# Altium project Blinky_Stick.PrjPcb
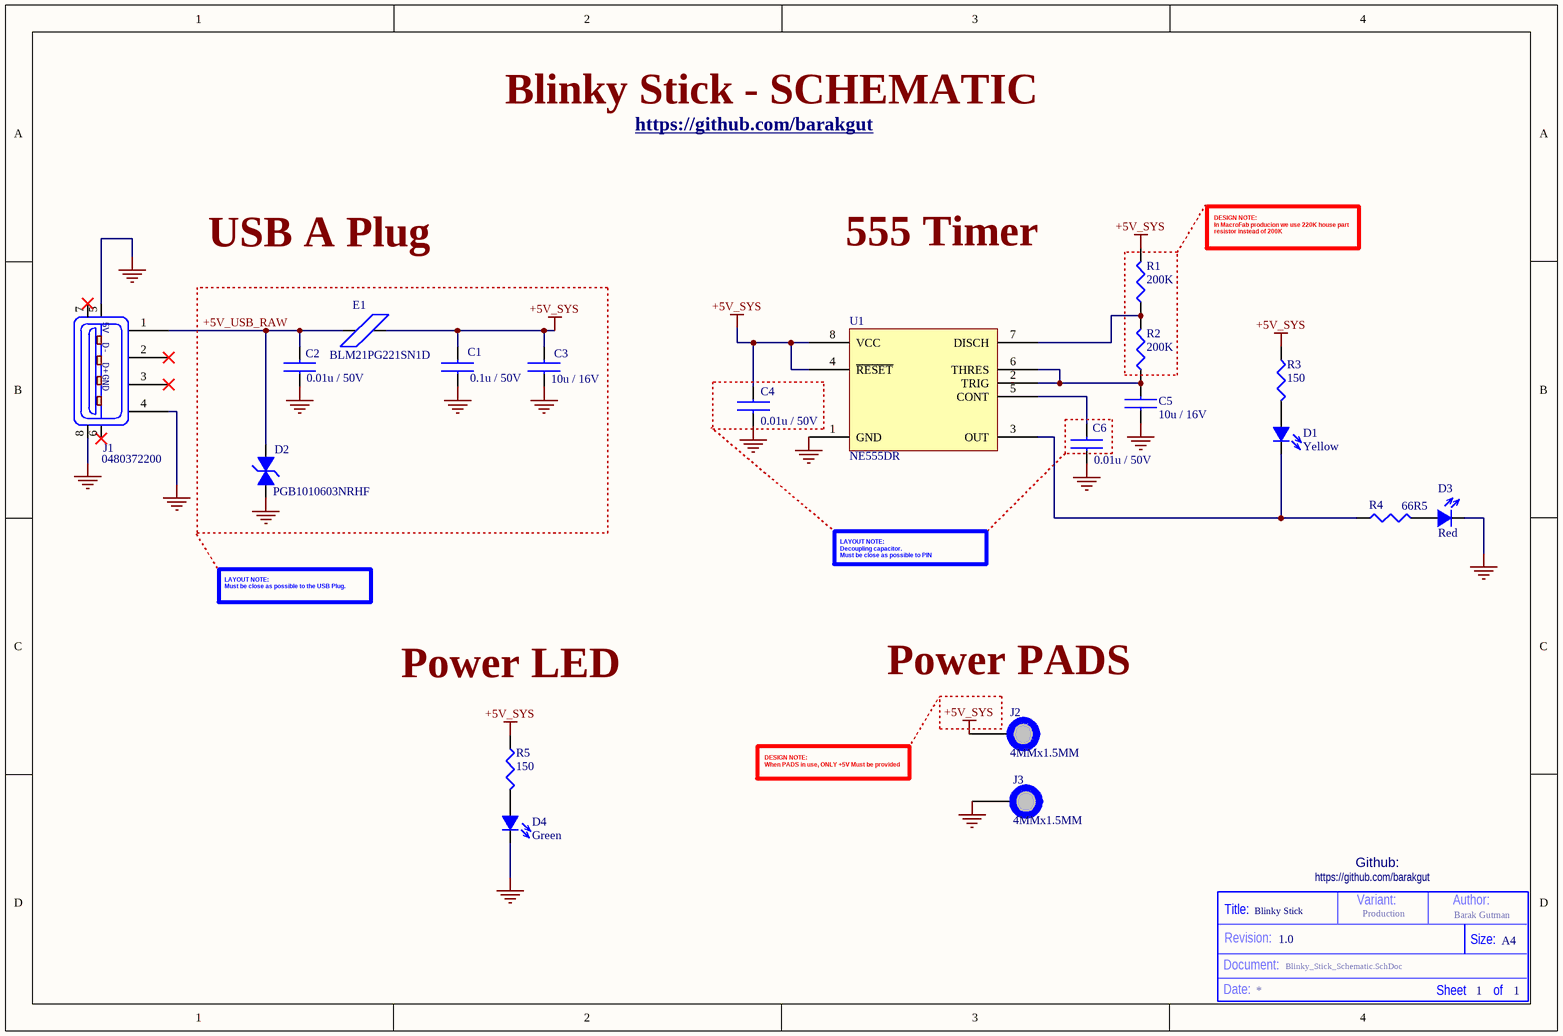
[diagram p0: Blinky_Stick_Schematic.SchDoc]
1 sheet, 20 parts. Net scope: global (net labels, ports and power ports of the same name join across sheets).
Board file: Blinky_Stick_PCB.PcbDoc

## Sheet Blinky_Stick_Schematic.SchDoc: Blinky Stick
size A4; Author: Barak Gutman; Revision: 1.0; SheetNumber: 1; SheetTotal: 1; Variant: Production

### Parts
C1  0.1u / 50V  [C0805]
C2  0.01u / 50V  [C0805]
C3  10u / 16V  [C0805]
C4  0.01u / 50V  [C0805]
C5  10u / 16V  [C0805]
C6  0.01u / 50V  [C0805]
D1  Yellow  [LED0805]
D2  PGB1010603NRHF  [DIODE_0603]
D3  Red  [LED0805]
D4  Green  [LED0805]
E1  BLM21PG221SN1D  [C0805]
J1  0480372200  [0480372200]
J2  4MMx1.5MM  [PAD_WITH_HOLE_4MMx1.5MM]  (no BOM)
J3  4MMx1.5MM  [PAD_WITH_HOLE_4MMx1.5MM]  (no BOM)
R1  200K  [R0805]
R2  200K  [R0805]
R3  150  [R0805]
R4  66R5  [R0805]
R5  150  [R0805]
U1  NE555DR  [SOIC-8_D_R-PDSO-G8]

### Nets
+5V_SYS: C1.2 C3.2 C4.2 E1.2 J2.1 R1.2 R3.1 R5.1 U1.4(~{RESET}) U1.8(VCC)
GND: C1.1 C2.1 C3.1 C4.1 C5.1 C6.1 D2.1 D3.2(Cathode) D4.2(Cathode) J1.4(GND) J1.5(GND) J1.8(MH) J3.1 U1.1(GND)
+5V_USB_RAW: C2.2 D2.2 E1.1 J1.1(5V)
NetC5_2: C5.2 R2.1 U1.2(TRIG) U1.6(THRES)
NetC6_2: C6.2 U1.5(CONT)
NetD1_1: D1.1(Anode) R3.2
NetD1_2: D1.2(Cathode) R4.1 U1.3(OUT)
NetD3_1: D3.1(Anode) R4.2
NetD4_1: D4.1(Anode) R5.2
NetR1_1: R1.1 R2.2 U1.7(DISCH)

Not connected (* = marked no-connect by the designer): J1 2(DM)* 3(DP)* 6(GND)* 7(MH)*

### Notes on the sheet
- Blinky Stick - SCHEMATIC
- https://github.com/barakgut
- DESIGN NOTE:
  In MacroFab producion we use 220K house part
  resistor instead of 200K
- USB A Plug
- 555 Timer
- LAYOUT NOTE:
  Decoupling capacitor.
  Must be close as possible to PIN
- LAYOUT NOTE:
  Must be close as possible to the USB Plug.
- Power LED
- (near J2) Power PADS
- DESIGN NOTE:
  When PADS in use, ONLY +5V Must be provided
- Title:
- Github:
- Variant:
- Author:
- Document:
- Revision:
- Size:
- A4
- Date:
- Sheet
- of
- (in symbol 0480372200) D-; D+

### Library data of the parts
C1 = C2012X7R1H104K085AA: CAP CER 0.1UF 50V X7R 0805; Manufacturer: TDK Corporation; Capacitance: 0.1µF; Tolerance: ±10%; Supplier 1: Digi-Key; Manufacturer Part Number: C2012X7R1H104K085AA; RoHS: RoHS Compliant; Category: Capacitors; Stock 1: 865489; Pricing 1: 1=0.11, 10=0.075, 25=0.0548, 50=0.0426, 100=0.0354, 250=0.02928, 500=0.0248, 1000=0.02053 (USD); Packaging: Cut Tape (CT); Part Status: Not For New Designs; Voltage - Rated: 50V; Temperature Coefficient: X7R; Operating Temperature: -55°C ~ 125°C; Features: Low ESL; Ratings: -; Applications: General Purpose; Failure Rate: -; Mounting Type: Surface Mount, MLCC; Package / Case: 0805 (2012 Metric); Size / Dimension: 0.079" L x 0.049" W (2.00mm x 1.25mm); Height - Seated (Max): -; Thickness (Max): 0.037" (0.95mm); Lead Spacing: -; Lead Style: -; ComponentLink1URL: https://product.tdk.com/info/en/catalog/datasheets/mlcc_commercial_general_en.pdf; ComponentLink1Description: https://product.tdk.com/info/en/catalog/datasheets/mlcc_commercial_general_en.pdf; Supplier Part Number 1: 445-7534-1-ND
C2 C4 C6 = C2012C0G1H103K060AA: CAP CER 10000PF 50V C0G 0805; Manufacturer: TDK Corporation; Tolerance: ±10%; Temperature Coefficient: C0G, NP0; Supplier 1: Digi-Key; Manufacturer Part Number: C2012C0G1H103K060AA; RoHS: RoHS Compliant; Category: Capacitors; Stock 1: 116011; Pricing 1: 1=0.35, 10=0.239, 25=0.1912, 50=0.1594, 100=0.1355, 250=0.1076, 500=0.09564, 1000=0.08368 (USD); Packaging: Cut Tape (CT); Part Status: Active; Capacitance: 10000pF; Voltage - Rated: 50V; Operating Temperature: -55°C ~ 125°C; Features: Low ESL; Ratings: -; Applications: General Purpose; Failure Rate: -; Mounting Type: Surface Mount, MLCC; Package / Case: 0805 (2012 Metric); Size / Dimension: 0.079" L x 0.049" W (2.00mm x 1.25mm); Height - Seated (Max): -; Thickness (Max): 0.030" (0.75mm); Lead Spacing: -; Lead Style: -; ComponentLink1URL: https://product.tdk.com/info/en/catalog/datasheets/mlcc_commercial_general_en.pdf; ComponentLink1Description: https://product.tdk.com/info/en/catalog/datasheets/mlcc_commercial_general_en.pdf; Supplier Part Number 1: 445-14311-1-ND
C3 C5 = C2012X5R1C106K085AC: CAP CER 10UF 16V X5R 0805; Manufacturer: TDK Corporation; Capacitance: 10µF; Tolerance: ±10%; Supplier 1: Digi-Key; Manufacturer Part Number: C2012X5R1C106K085AC; RoHS: RoHS Compliant; Category: Capacitors; Stock 1: 352135; Pricing 1: 1=0.24, 10=0.161, 25=0.118, 50=0.0966, 100=0.0816, 250=0.06656, 500=0.05582, 1000=0.04939 (USD); Packaging: Cut Tape (CT); Part Status: Active; Voltage - Rated: 16V; Temperature Coefficient: X5R; Operating Temperature: -55°C ~ 85°C; Features: Low ESL; Ratings: -; Applications: General Purpose; Failure Rate: -; Mounting Type: Surface Mount, MLCC; Package / Case: 0805 (2012 Metric); Size / Dimension: 0.079" L x 0.049" W (2.00mm x 1.25mm); Height - Seated (Max): -; Thickness (Max): 0.037" (0.95mm); Lead Spacing: -; Lead Style: -; ComponentLink1URL: https://product.tdk.com/info/en/catalog/datasheets/mlcc_commercial_general_en.pdf; ComponentLink1Description: https://product.tdk.com/info/en/catalog/datasheets/mlcc_commercial_general_en.pdf; Supplier Part Number 1: 445-7644-1-ND
D1 = LTST-C171KSKT: LED YELLOW CLEAR 0805 SMD; Manufacturer: Lite-On Inc.; Lens Color: Colorless; Millicandela Rating: 50mcd; Lens Style/Size: Rectangle with Flat Top, 1.40mm x 1.25mm; Voltage - Forward (Vf) (Typ): 2V; Current - Test: 20mA; Viewing Angle: 130°; Wavelength - Dominant: 587nm; Wavelength - Peak: 588nm; Supplier 1: Digi-Key; Manufacturer Part Number: LTST-C171KSKT; RoHS: RoHS Compliant; Category: Optoelectronics; Stock 1: 88031; Pricing 1: 1=0.33, 10=0.239, 25=0.1764, 100=0.126, 250=0.08564, 500=0.07558, 1000=0.0592 (USD); Packaging: Cut Tape (CT); Part Status: Active; Color: Yellow; Lens Transparency: Clear; Mounting Type: Surface Mount; Features: -; Package / Case: 0805 (2012 Metric); Size / Dimension: 2.00mm L x 1.25mm W; Height (Max): 0.80mm; ComponentLink1URL: http://optoelectronics.liteon.com/upload/download/DS22-2000-110/S_110_LTST-C171KSKT.pdf; ComponentLink1Description: http://optoelectronics.liteon.com/upload/download/DS22-2000-110/S_110_LTST-C171KSKT.pdf; Supplier Part Number 1: 160-1428-1-ND
D2 = PGB1010603NRHF: TVS DIODE 24VWM 150VC 0603; Manufacturer: Littelfuse Inc.; Type: Zener; Voltage - Reverse Standoff (Typ): 24V; Voltage - Clamping (Max) @ Ipp: 150V (Typ); Power Line Protection: No; Supplier 1: Digi-Key; Manufacturer Part Number: PGB1010603NRHF; RoHS: RoHS Compliant; Category: Circuit Protection; Stock 1: 21734; Pricing 1: 1=0.68, 10=0.577, 25=0.5048, 100=0.4326, 250=0.37492, 500=0.31724, 1000=0.24514, 2500=0.22351 (USD); Packaging: Cut Tape (CT); Part Status: Active; Voltage - Breakdown (Min): -; Current - Peak Pulse (10/1000µs): -; Power - Peak Pulse: -; Applications: General Purpose; Capacitance @ Frequency: -; Operating Temperature: -65°C ~ 125°C (TJ); Mounting Type: Surface Mount; Package / Case: 0603 (1608 Metric); Supplier Device Package: 0603 (1608 Metric); ComponentLink1URL: http://www.littelfuse.com/data/en/data_sheets/littelfuse_pulseguard-esd_pgb1.pdf; ComponentLink1Description: http://www.littelfuse.com/data/en/data_sheets/littelfuse_pulseguard-esd_pgb1.pdf; Supplier Part Number 1: F4239CT-ND
D3 = LTST-C171KRKT: LED RED CLEAR 0805 SMD; Manufacturer: Lite-On Inc.; Lens Color: Colorless; Millicandela Rating: 54mcd; Lens Style/Size: Rectangle with Flat Top, 1.40mm x 1.25mm; Voltage - Forward (Vf) (Typ): 2V; Current - Test: 20mA; Viewing Angle: 130°; Wavelength - Dominant: 631nm; Wavelength - Peak: 639nm; Supplier 1: Digi-Key; Manufacturer Part Number: LTST-C171KRKT; RoHS: RoHS Compliant; Category: Optoelectronics; Stock 1: 187649; Pricing 1: 1=0.31, 10=0.225, 25=0.1656, 100=0.1183, 250=0.0804, 500=0.07096, 1000=0.05558 (USD); Packaging: Cut Tape (CT); Part Status: Active; Color: Red; Lens Transparency: Clear; Mounting Type: Surface Mount; Features: -; Package / Case: 0805 (2012 Metric); Size / Dimension: 2.00mm L x 1.25mm W; Height (Max): 0.80mm; ComponentLink1URL: http://optoelectronics.liteon.com/upload/download/DS22-2000-109/S_110_LTST-C171KRKT.pdf; ComponentLink1Description: http://optoelectronics.liteon.com/upload/download/DS22-2000-109/S_110_LTST-C171KRKT.pdf; Supplier Part Number 1: 160-1427-1-ND
D4 = LTST-C171GKT: LED GREEN CLEAR 0805 SMD; Manufacturer: Lite-On Inc.; Lens Color: Colorless; Millicandela Rating: 12mcd; Lens Style/Size: Rectangle with Flat Top, 1.40mm x 1.25mm; Voltage - Forward (Vf) (Typ): 2.1V; Current - Test: 20mA; Viewing Angle: 130°; Wavelength - Dominant: 569nm; Wavelength - Peak: 565nm; Supplier 1: Digi-Key; Manufacturer Part Number: LTST-C171GKT; RoHS: RoHS Compliant; Category: Optoelectronics; Stock 1: 290256; Pricing 1: 1=0.29, 10=0.211, 25=0.1556, 100=0.1111, 250=0.07556, 500=0.06666, 1000=0.05222 (USD); Packaging: Cut Tape (CT); Part Status: Active; Color: Green; Lens Transparency: Clear; Mounting Type: Surface Mount; Features: -; Package / Case: 0805 (2012 Metric); Supplier Device Package: Chip LED; Size / Dimension: 2.00mm L x 1.25mm W; Height (Max): 0.80mm; ComponentLink1URL: http://media.digikey.com/pdf/Data%20Sheets/Lite-On%20PDFs/LTST-C171GKT.pdf; ComponentLink1Description: http://media.digikey.com/pdf/Data%20Sheets/Lite-On%20PDFs/LTST-C171GKT.pdf; Supplier Part Number 1: 160-1423-1-ND
E1 = BLM21PG221SN1D: FERRITE BEAD 220 OHM 0805 1LN; Manufacturer: Murata Electronics North America; Filter Type: Power Line; Number of Lines: 1; Impedance @ Frequency: 220 Ohm @ 100MHz; Current Rating (Max): 2A; DC Resistance (DCR) (Max): 45 mOhm; Supplier 1: Digi-Key; Manufacturer Part Number: BLM21PG221SN1D; RoHS: RoHS Compliant; Category: Filters; Stock 1: 1078828; Pricing 1: 1=0.1, 10=0.081, 25=0.0732, 50=0.0538, 100=0.0464, 250=0.03664, 500=0.03094, 1000=0.02605 (USD); Packaging: Cut Tape (CT); Part Status: Active; Ratings: -; Operating Temperature: -55°C ~ 125°C; Package / Case: 0805 (2012 Metric); Mounting Type: Surface Mount; Height (Max): 0.041" (1.05mm); Size / Dimension: 0.079" L x 0.049" W (2.00mm x 1.25mm); ComponentLink1URL: http://www.murata.com/en-us/products/productdata/8796738977822/ENFA0005.pdf; ComponentLink1Description: http://www.murata.com/en-us/products/productdata/8796738977822/ENFA0005.pdf; Supplier Part Number 1: 490-1054-1-ND
J1 = 0480372200: CONN PLUG USB A 4POS SMD R/A; Manufacturer: Molex, LLC; Connector Type: USB - A; Number of Contacts: 4; Specifications: USB 2.0; Number of Ports: 1; Current Rating: 1.5A; Voltage - Rated: 150VAC; Shielding: Shielded; Material Flammability Rating: UL94 V-0; Supplier 1: Digi-Key; Manufacturer Part Number: 0480372200; RoHS: RoHS Compliant; Category: Connectors, Interconnects; Stock 1: 12435; Pricing 1: 1=1.24, 10=1.09, 25=1.0256, 50=0.983, 100=0.9402 (USD); Packaging: Cut Tape (CT); Part Status: Active; Gender: Plug; Mounting Type: Surface Mount, Right Angle; Through Hole; Mounting Feature: Horizontal; Termination: Solder; Features: Board Guide; Ingress Protection: -; Operating Temperature: -20°C ~ 85°C; Mating Cycles: -; Contact Finish: Gold; Shell/Shielding Material: Steel; Insulation Color: Black; ComponentLink1URL: http://www.molex.com/pdm_docs/sd/480372200_sd.pdf; ComponentLink1Description: http://www.molex.com/pdm_docs/sd/480372200_sd.pdf; Supplier Part Number 1: WM3983CT-ND
J2 J3 = PAD_WITH_HOLE_4MMx1.5MM: Pad with hole 4mm x 1.5mm
R1 R2 = RC0805FR-07200KL: RES SMD 200K OHM 1% 1/8W 0805; Manufacturer: Yageo; Power (Watts): 0.125W, 1/8W; Temperature Coefficient: ±100ppm/°C; Supplier 1: Digi-Key; Manufacturer Part Number: RC0805FR-07200KL; RoHS: RoHS Compliant; Category: Resistors; Stock 1: 1014107; Pricing 1: 1=0.1, 10=0.019, 25=0.0136, 50=0.0104, 100=0.0077, 250=0.00584, 500=0.00468, 1000=0.00345 (USD); Packaging: Cut Tape (CT); Part Status: Active; Resistance (Ohms): 200k; Tolerance: ±1%; Composition: Thick Film; Features: Moisture Resistant; Operating Temperature: -55°C ~ 155°C; Package / Case: 0805 (2012 Metric); Supplier Device Package: 0805; Size / Dimension: 0.079" L x 0.049" W (2.00mm x 1.25mm); Height - Seated (Max): 0.024" (0.60mm); Failure Rate: -; ComponentLink1URL: http://www.yageo.com/documents/recent/PYu-RC_Group_51_RoHS_L_7.pdf; ComponentLink1Description: http://www.yageo.com/documents/recent/PYu-RC_Group_51_RoHS_L_7.pdf; Supplier Part Number 1: 311-200KCRCT-ND
R3 R5 = RC0805FR-07150RL: RES SMD 150 OHM 1% 1/8W 0805; Manufacturer: Yageo; Power (Watts): 0.125W, 1/8W; Temperature Coefficient: ±100ppm/°C; Supplier 1: Digi-Key; Manufacturer Part Number: RC0805FR-07150RL; RoHS: RoHS Compliant; Category: Resistors; Stock 1: 812494; Pricing 1: 1=0.1, 10=0.019, 25=0.0136, 50=0.0104, 100=0.0077, 250=0.00584, 500=0.00468, 1000=0.00345 (USD); Packaging: Cut Tape (CT); Part Status: Active; Resistance (Ohms): 150; Tolerance: ±1%; Composition: Thick Film; Features: Moisture Resistant; Operating Temperature: -55°C ~ 155°C; Package / Case: 0805 (2012 Metric); Supplier Device Package: 0805; Size / Dimension: 0.079" L x 0.049" W (2.00mm x 1.25mm); Height - Seated (Max): 0.024" (0.60mm); Failure Rate: -; ComponentLink1URL: http://www.yageo.com/documents/recent/PYu-RC_Group_51_RoHS_L_7.pdf; ComponentLink1Description: http://www.yageo.com/documents/recent/PYu-RC_Group_51_RoHS_L_7.pdf; Supplier Part Number 1: 311-150CRCT-ND
R4 = RC0805FR-0766R5L: RES SMD 66.5 OHM 1% 1/8W 0805; Manufacturer: Yageo; Resistance (Ohms): 66.5; Power (Watts): 0.125W, 1/8W; Temperature Coefficient: ±100ppm/°C; Supplier 1: Digi-Key; Manufacturer Part Number: RC0805FR-0766R5L; RoHS: RoHS Compliant; Category: Resistors; Stock 1: 27446; Pricing 1: 1=0.1, 10=0.019, 25=0.0136, 50=0.0104, 100=0.0077, 250=0.00584, 500=0.00468, 1000=0.00345 (USD); Packaging: Cut Tape (CT); Part Status: Active; Tolerance: ±1%; Composition: Thick Film; Features: Moisture Resistant; Operating Temperature: -55°C ~ 155°C; Package / Case: 0805 (2012 Metric); Supplier Device Package: 0805; Size / Dimension: 0.079" L x 0.049" W (2.00mm x 1.25mm); Height - Seated (Max): 0.024" (0.60mm); Failure Rate: -; ComponentLink1URL: http://www.yageo.com/documents/recent/PYu-RC_Group_51_RoHS_L_7.pdf; ComponentLink1Description: http://www.yageo.com/documents/recent/PYu-RC_Group_51_RoHS_L_7.pdf; Supplier Part Number 1: 311-66.5CRCT-ND
U1 = NE555DR: IC OSC SGL TIMER 100KHZ 8-SOIC; Manufacturer: Texas Instruments; Voltage - Supply: 4.5 V ~ 16 V; Current - Supply: 10mA; Supplier 1: Digi-Key; Manufacturer Part Number: NE555DR; RoHS: RoHS Compliant; Category: Integrated Circuits (ICs); Stock 1: 20860; Pricing 1: 1=0.47, 10=0.352, 100=0.2192, 500=0.14996, 1000=0.11536 (USD); Packaging: Cut Tape (CT); Part Status: Active; Type: 555 Type, Timer/Oscillator (Single); Count: -; Frequency: 100kHz; Operating Temperature: 0°C ~ 70°C; Package / Case: 8-SOIC (0.154", 3.90mm Width); Supplier Device Package: 8-SOIC; Mounting Type: Surface Mount; ComponentLink1URL: http://www.ti.com/lit/ds/symlink/ne555.pdf; ComponentLink1Description: http://www.ti.com/lit/ds/symlink/ne555.pdf; Supplier Part Number 1: 296-6501-1-ND